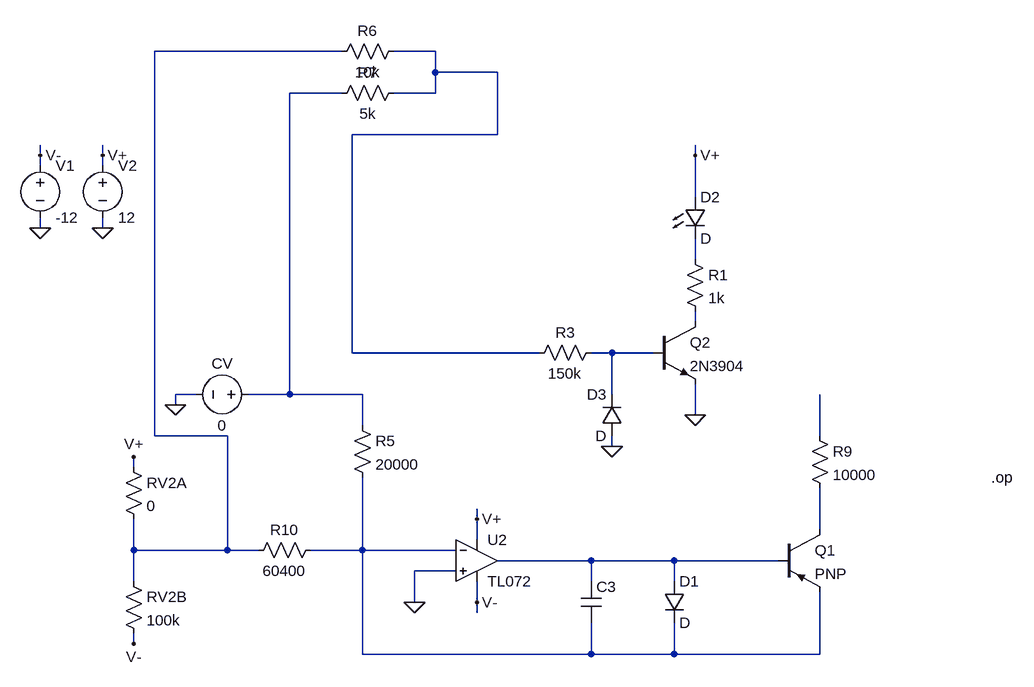
[diagram p0: schematic fadex4u final vca.asc]
fadex4u final vca.asc, the LTspice schematic file:
Version 4
SHEET 1 1516 844
WIRE 480 -128 192 -128
WIRE 624 -128 560 -128
WIRE 624 -96 624 -128
WIRE 688 -96 624 -96
WIRE 720 -96 688 -96
WIRE 480 -64 400 -64
WIRE 624 -64 624 -96
WIRE 624 -64 560 -64
WIRE 720 0 720 -96
WIRE 720 0 496 0
WIRE 16 32 16 16
WIRE 112 32 112 16
WIRE 1024 32 1024 16
WIRE 16 48 16 32
WIRE 112 48 112 32
WIRE 1024 96 1024 32
WIRE 16 144 16 128
WIRE 112 144 112 128
WIRE 1024 176 1024 160
WIRE 1024 192 1024 176
WIRE 1024 288 1024 272
WIRE 496 336 496 0
WIRE 784 336 496 336
WIRE 896 336 864 336
WIRE 960 336 896 336
WIRE 256 400 224 400
WIRE 400 400 400 -64
WIRE 400 400 336 400
WIRE 512 400 400 400
WIRE 896 400 896 336
WIRE 224 416 224 400
WIRE 1024 432 1024 384
WIRE 1216 432 1216 400
WIRE 512 448 512 400
WIRE 192 464 192 -128
WIRE 304 464 192 464
WIRE 1216 464 1216 432
WIRE 896 480 896 464
WIRE 160 512 160 496
WIRE 512 592 512 528
WIRE 688 592 688 576
WIRE 1216 608 1216 544
WIRE 688 624 688 592
WIRE 160 640 160 592
WIRE 304 640 304 464
WIRE 304 640 160 640
WIRE 352 640 304 640
WIRE 512 640 512 592
WIRE 512 640 432 640
WIRE 576 640 512 640
WIRE 656 640 576 640
WIRE 864 656 720 656
WIRE 992 656 864 656
WIRE 1056 656 992 656
WIRE 1152 656 1056 656
WIRE 656 672 592 672
WIRE 160 688 160 640
WIRE 864 688 864 656
WIRE 992 688 992 656
WIRE 592 720 592 672
WIRE 688 720 688 688
WIRE 688 736 688 720
WIRE 160 784 160 768
WIRE 512 800 512 640
WIRE 864 800 864 752
WIRE 864 800 512 800
WIRE 992 800 992 752
WIRE 992 800 864 800
WIRE 1216 800 1216 704
WIRE 1216 800 992 800
FLAG 16 144 0
FLAG 112 144 0
FLAG 16 32 V-
FLAG 112 32 V+
FLAG 160 496 V+
FLAG 160 784 V-
FLAG 224 416 0
FLAG 592 720 0
FLAG 688 592 V+
FLAG 688 720 V-
FLAG 1024 32 V+
FLAG 1024 432 0
FLAG 896 480 0
DATAFLAG 576 640 "$"
DATAFLAG 1216 432 "$"
DATAFLAG 1056 656 "$"
DATAFLAG 1024 176 "$"
DATAFLAG 512 592 "$"
DATAFLAG 688 -96 "$"
SYMBOL voltage 16 32 R0
SYMATTR InstName V1
SYMATTR Value -12
SYMBOL voltage 112 32 R0
SYMATTR InstName V2
SYMATTR Value 12
SYMBOL res 144 672 R0
SYMATTR InstName RV2B
SYMATTR Value 100k
SYMBOL res 448 624 R90
WINDOW 0 0 56 VBottom 2
WINDOW 3 32 56 VTop 2
SYMATTR InstName R10
SYMATTR Value 60400
SYMBOL voltage 352 400 R90
WINDOW 0 -32 56 VBottom 2
WINDOW 3 32 56 VTop 2
SYMATTR InstName CV
SYMATTR Value 0
SYMBOL res 496 432 R0
SYMATTR InstName R5
SYMATTR Value 20000
SYMBOL TL072 688 592 R0
SYMATTR InstName U2
SYMBOL cap 848 688 R0
WINDOW 3 115 56 Invisible 2
SYMATTR Value 0.00000000033
SYMATTR InstName C3
SYMBOL diode 976 688 R0
SYMATTR InstName D1
SYMBOL pnp 1152 608 R0
SYMATTR InstName Q1
SYMBOL res 1200 448 R0
SYMATTR InstName R9
SYMATTR Value 10000
SYMBOL res 144 496 R0
SYMATTR InstName RV2A
SYMATTR Value 0
SYMBOL LED 1008 96 R0
SYMATTR InstName D2
SYMBOL res 1008 176 R0
SYMATTR InstName R1
SYMATTR Value 1k
SYMBOL npn 960 288 R0
SYMATTR InstName Q2
SYMATTR Value 2N3904
SYMBOL res 880 320 R90
WINDOW 0 0 56 VBottom 2
WINDOW 3 32 56 VTop 2
SYMATTR InstName R3
SYMATTR Value 150k
SYMBOL diode 912 464 R180
WINDOW 0 24 64 Left 2
WINDOW 3 24 0 Left 2
SYMATTR InstName D3
SYMBOL res 576 -144 R90
WINDOW 0 0 56 VBottom 2
WINDOW 3 32 56 VTop 2
SYMATTR InstName R6
SYMATTR Value 10k
SYMBOL res 576 -80 R90
WINDOW 0 0 56 VBottom 2
WINDOW 3 32 56 VTop 2
SYMATTR InstName R7
SYMATTR Value 5k
TEXT 1480 528 Left 2 !.op

The netlist it stands for:
* fadex4u final vca.asc
V1 V- 0 -12
V2 V+ 0 12
RV2B N001 V- 100k
R10 N008 N001 60400
V§CV N003 0 0
R5 N003 N008 20000
* U2: TL072 (symbol TL072 not available, pins judged from their places): In+=0 In-=N008 V+=V+ V-=V- OUT=N010
C3 N010 N008 0.00000000033
D1 N010 N008 D
Q1 N009 N010 N008 0 PNP
R9 N007 N009 10000
RV2A V+ N001 0
D2 V+ N004 D
R1 N004 N005 1k
Q2 N005 N006 0 0 2N3904
R3 N006 N002 150k
D3 0 N006 D
R6 N002 N001 10k
R7 N002 N003 5k
.model D D
.lib standard.dio
.model NPN NPN
.model PNP PNP
.lib standard.bjt
.op
.backanno
.end